# Altium schematic sheet 02_ESP12_CORE.SchDoc: ESP-12 CORE
size A4; Date: 20/11/2014; Author: HuangRui <vowstar@gmail.com>; DrawnBy: JiYaping <jyp1817@gmail.com>; Organization: WWW.NODEMCU.COM
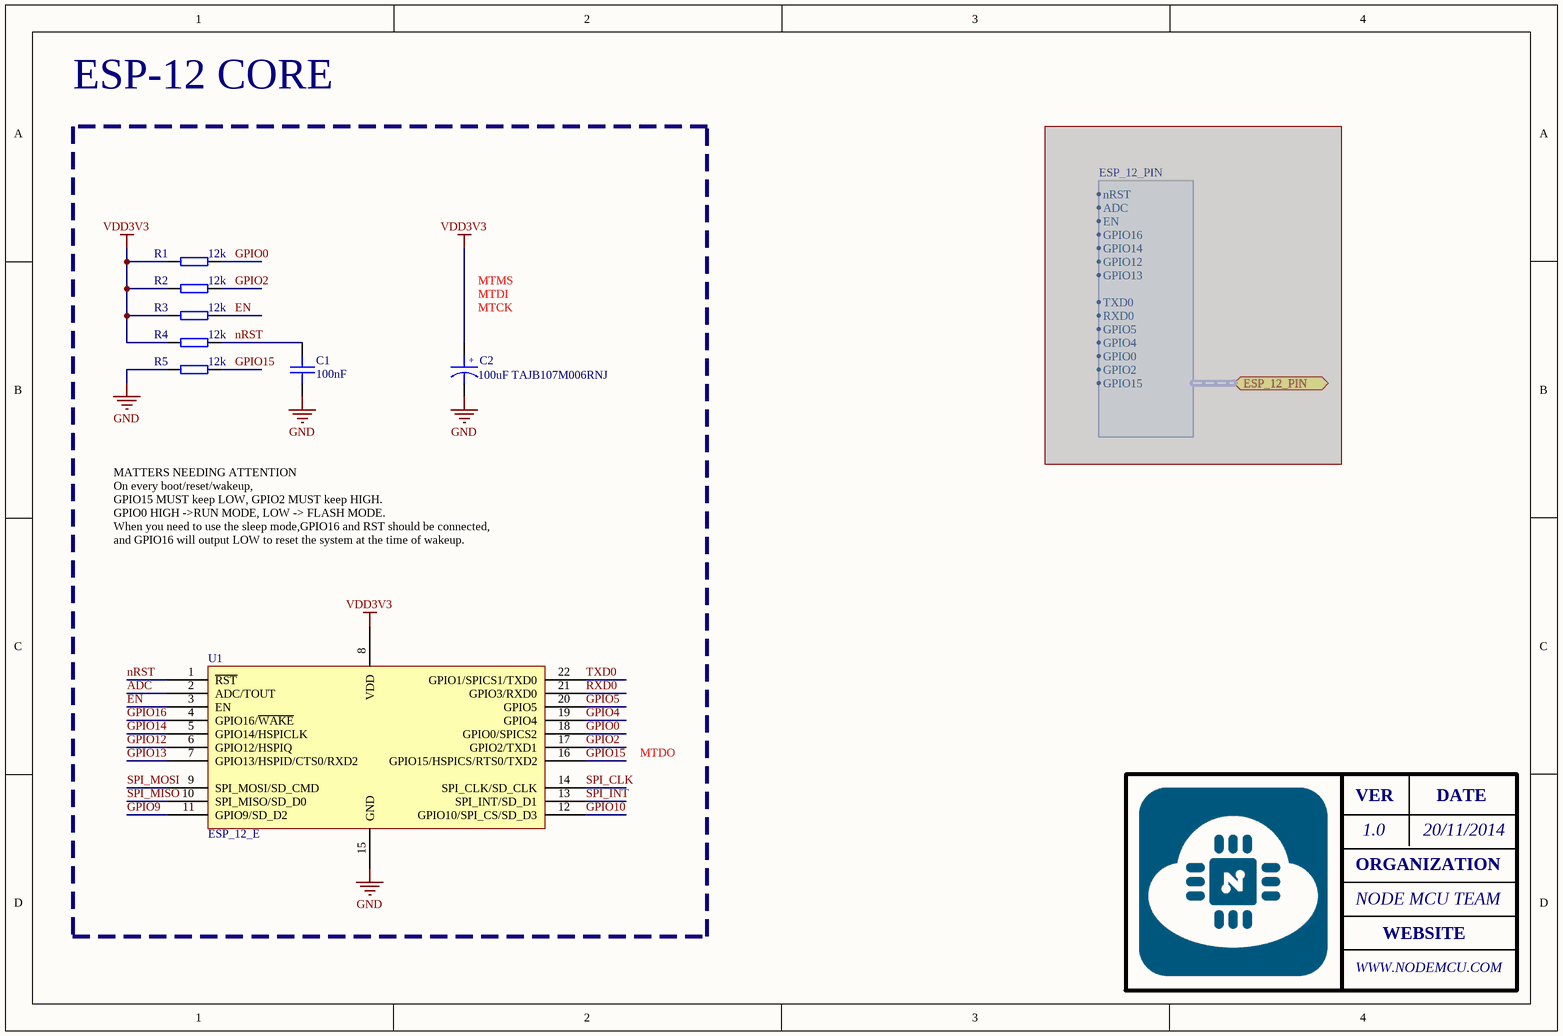
[diagram p0: 02_ESP12_CORE.SchDoc]

## Parts
C1  100nF  [SMT_C_0402]
C2  100uF TAJB107M006RNJ  [SMT_C_Tantalum_B]
R1  12k  [SMT_R_0603]
R2  12k  [SMT_R_0603]
R3  12k  [SMT_R_0603]
R4  12k  [SMT_R_0603]
R5  12k  [SMT_R_0603]
U1  ESP_12_E  [ESP_12_E_L]

## Ports
ESP_12_PIN (harness ESP_12_PIN)

## Harnesses
ESP_12_PIN: nRST, ADC, EN, GPIO16, GPIO12, GPIO13, GPIO14, TXD0, RXD0, GPIO4, GPIO5, GPIO0, GPIO2, GPIO15

## Nets
GND: C1.2 C2.2 R5.1 U1.15(GND)
VDD3V3: C2.1 R1.1 R2.1 R3.1 R4.1 U1.8(VDD)
ADC: U1.2(ADC/TOUT)
EN: R3.2 U1.3(EN)
GPIO0: R1.2 U1.18(GPIO0/SPICS2)
GPIO2: R2.2 U1.17(GPIO2/TXD1)
GPIO4: U1.19(GPIO4)
GPIO5: U1.20(GPIO5)
GPIO9: U1.11(GPIO9/SD_D2)
GPIO10: U1.12(GPIO10/SPI_CS/SD_D3)
GPIO12: U1.6(GPIO12/HSPIQ)
GPIO13: U1.7(GPIO13/HSPID/CTS0/RXD2)
GPIO14: U1.5(GPIO14/HSPICLK)
GPIO15: R5.2 U1.16(GPIO15/HSPICS/RTS0/TXD2)
GPIO16: U1.4(GPIO16/~{WAKE})
nRST: C1.1 R4.2 U1.1(~{RST})
RXD0: U1.21(GPIO3/RXD0)
SPI_CLK: U1.14(SPI_CLK/SD_CLK)
SPI_INT: U1.13(SPI_INT/SD_D1)
SPI_MISO: U1.10(SPI_MISO/SD_D0)
SPI_MOSI: U1.9(SPI_MOSI/SD_CMD)
TXD0: U1.22(GPIO1/SPICS1/TXD0)

## Notes on the sheet
- (near C2) MTCK
- MTDI
- MTMS
- MATTERS NEEDING ATTENTION
  On every boot/reset/wakeup,
  GPIO15 MUST keep LOW, GPIO2 MUST keep HIGH.
  GPIO0 HIGH ->RUN MODE, LOW -> FLASH MODE.
  When you need to use the sleep mode,GPIO16 and RST should be connected,
  and GPIO16 will output LOW to reset the system at the time of wakeup.
- MTDO
- VER
- 1.0
- DATE
- ORGANIZATION
- NODE MCU TEAM
- WEBSITE
- (in symbol SMT_C_Tantalum_B) +

## Library data of the parts
C1 = SMT_C_0402: Surface mount capacitor 0402
C2 = SMT_C_Tantalum_B: Capacitor, SM Tantalum; Body 3.5 x 2.8 mm (LxW typ)
R1-R5 = SMT_R_0402: Surface mount resistor 0402
U1 = ESP_12_E: ESP-12 Wi-Fi Module by AI-Thinker; IC: ESP8266-EX; Vendor: Ai-thinker